# Altium schematic sheet Kajtuś-DSP_power_supply.SchDoc
size A4; DocumentNumber: 9; SheetNumber: 9; SheetTotal: 9
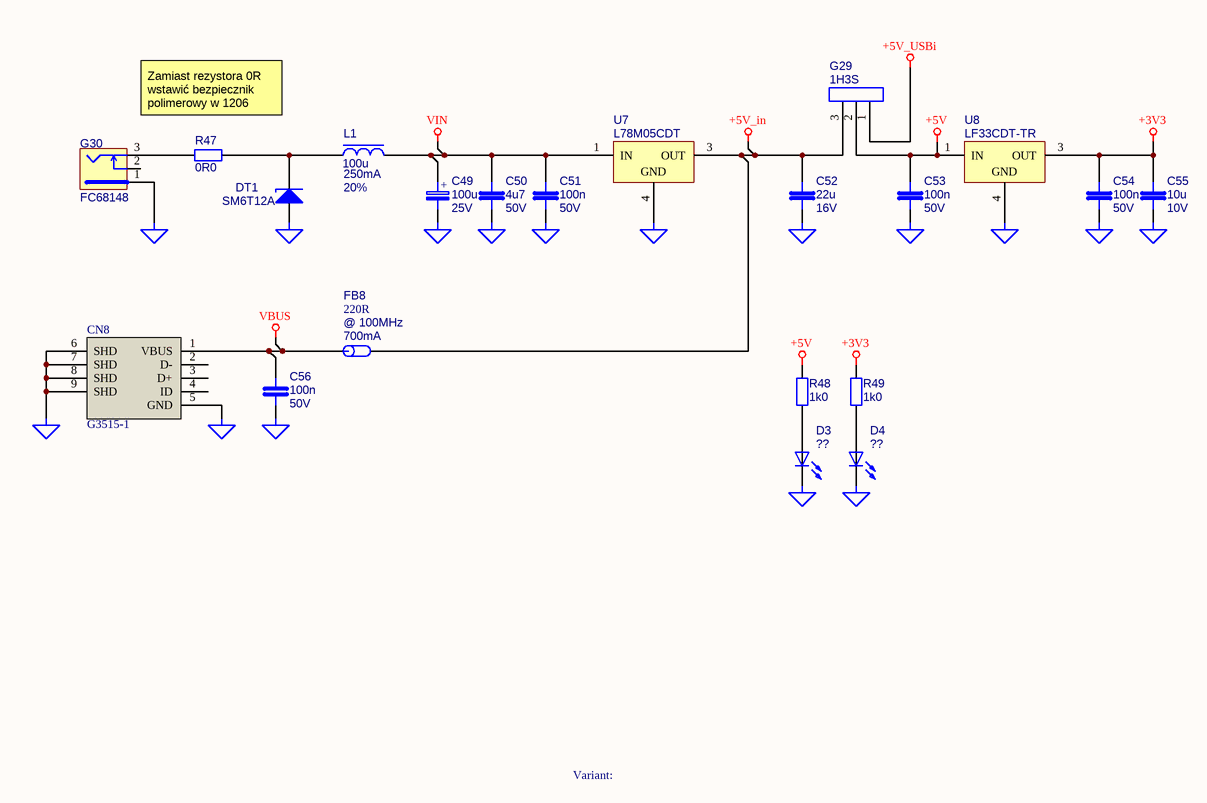
[diagram p0: Kajtuś-DSP_power_supply.SchDoc]

## Parts
C49  100u  Voltage: 25V  [CAPPRD-035-W06-D063-H115]
C50  4u7  Voltage: 50V  [C_1206]
C51  100n  Voltage: 50V  [C_0603]
C52  22u  Voltage: 16V  [C_1206]
C53  100n  Voltage: 50V  [C_0603]
C54  100n  Voltage: 50V  [C_0603]
C55  10u  Voltage: 10V  [C_0805]
C56  100n  Voltage: 50V  [C_0603]
CN8  G3515-1  [CN_USB_mini_B_G3515-1]
D3  ??  [LED_0805_G]
D4  ??  [LED_0805_G]
DT1  SM6T12A  [SMB]
FB8  220R  Frequency: @ 100MHz  Current: 700mA  [FB_0603]
G29  value 1H3S  [1H3S_FHS]  (hidden comment: G_1H3S)
G30  FC68148  [CN_DC_PWR_5.5x2.1_FC68148]
L1  100u  Tolerance: 20%  Current_RMS: 250mA  [Walsin_303015]
R47  value 0R0  [R_1206]  (hidden comment: R_1206_0R0_5%)
R48  value 1k0  [R_0603_MA]  (hidden comment: R_0603_1k0_5%)
R49  value 1k0  [R_0603_MA]  (hidden comment: R_0603_1k0_5%)
U7  L78M05CDT  [TO-252]
U8  LF33CDT-TR  [TO-252_M]

## Nets
+3V3: C54.1 C55.1 R49.1 U8.3(OUT)
+5V: C53.1 G29.2 R48.1 U8.1(IN)
+5V_in: C52.1 FB8.2 G29.3 U7.3(OUT)
+5V_USBi: G29.1
GND: C49.2 C50.2 C51.2 C52.2 C53.2 C54.2 C55.2 C56.2 CN8.5(GND) CN8.6(SHD) CN8.7(SHD) CN8.8(SHD) CN8.9(SHD) D3.2(K) D4.2(K) DT1.2(A) G30.1 U7.4(GND) U8.4(GND)
VBUS: C56.1 CN8.1(VBUS) FB8.1
VIN: C49.1 C50.1 C51.1 L1.2 U7.1(IN)
NetD3_1: D3.1(A) R48.2
NetD4_1: D4.1(A) R49.2
NetDT1_1: DT1.1(C) L1.1 R47.2
NetG30_3: G30.3 R47.1

Not connected (* = marked no-connect by the designer): CN8 2(D-) 3(D+) 4(ID); G30 2

## Notes on the sheet
- Zamiast rezystora 0R wstawić bezpiecznik polimerowy w 1206
- Variant:
- Title
- Size:
- Date:
- A4
- Number:
- Time:
- Revision:
- Sheet
- of
- File:
- (in symbol CE_CAPPRD-035-W06-D063-H115_100u_25V) +

## Library data of the parts
C49 = CE_CAPPRD-035-W06-D063-H115_100u_25V: Aluminum Electrolytic Capacitor, D6.3, H11.5, 100u, 25V, 20%; Parameters: 100u/25V; 20%  6.3x11.5; Tolerance: 20%
C50 = C_1206_4u7_50V_X7R: Ceramic SMD 1206 Capacitor, 4u7, 50V, 10%, X7R; Parametry: 4,7uF, 10%, 50V, X7R; Producent: Hitano; Oznaczenie: 1206 B 475 K 500 N T; Tolerance: 10%; Package: 1206; Dielectric: X7R
C51 C53 C54 = C_0603_100n_50V_X7R: Ceramic SMD 0603 Capacitor, 100n, 50V, X7R; Parametry: 100n; 10%; 50V; X7R; Producent: Hitano; Oznaczenie: 0603 B 104 K 500 N T; Tolerance: 10%; Package: 0603
C52 = C_1206_22u_16V_X5R: Ceramic SMD 1206 Capacitor, 22u, 16V, 10%, X5R; Parametry: 22uF, 20%, 16V, X7R; Producent: Hitano; Oznaczenie: 1206 X 226 M 160 N T; Package: 1206; Tolerance: 10%; Dielectric: X5R
C55 = C_0805_10u_10V_X5R: Ceramic SMD 0805 Capacitor, 10u, 10V, X5R; Parametry: 10u; 10%; 10V; X5R; Producent: Hitano; Oznaczenie: 0805 X 106 K 100 N T; Tolerance: 10%; Package: 0805
C56 = C_0603_100n_50V_X7R: Ceramic SMD 0603 Capacitor, 100n, 50V, X7R; Producent: Hitano; Oznaczenie: 0603 B 104 K 500 N T; Parametry: 100n; 10%; 50V; X7R; Tolerance: 10%; Package: 0603
CN8 = CN_USB_mini-B_G3515-1: Mini USB 1u" S/G W/O Mark S-Type; Producent: Wieson Technologies; Parametry: PIN:5; kątowe, SMD; Oznaczenie: G3515-1; Oznaczenie2: ?; Producent2: ?
D3 D4 = LED_SMD_generic: Dioda LED SMD; Vendor: ??; Part Number: LED_SMD_generic; Manufacturer: ??; Voltage: ??; Current: ??; Manufacturer Part Number: ??; Value: ??
DT1 = DT_SMB_SM6T12A: Dioda Transil, 12V, 600W @ 10/1000us, jednokierunkowa; Manufacturer: Vishay; Voltage: 33V; VBR_min: 11,4V; VBR_max: 12,6V; VC @ 10/1000us: 16,7V; Producent: Vishay; Parametry: 12V, 600W @ 10/1000us, jednokierunkowa; Oznaczenie: SM6T12A; Value: SM6T12A; Supplier 1: TME; Supplier Part Number 1: SM6T12A-E3/52
FB8 = FB_0603_220R_100MHz_700mA: Ferrite Bead; Oznaczenie2: BLM15EG221SN1; Producent2: muRata; Parametry: 220R/100MHz; 700mA; Rdc=0,28; Producent: Erocore; Oznaczenie: CPGF100505T-221Y; Resistance: 0R28; Value: 220R
G29 = G_1H3S: Listwa jednorzędowa, 1x3 piny, raster 2,54mm; Manufacturer: generic; Vendor: TME; Part Number: G_1H3S
G30 = CN_DC_PWR_5.5x2.1_FC68148: DC Power Socket, 5.5mm x 2.1mm, with switch; Vendor: TME; Producent: Cliff; Value: FC68148; Supplier 1: TME; Supplier Part Number 1: FC68148
L1 = L_SMD_303015_WLPN303015M101PB_100u_250mA_20%: Shielded SMD Power Inductors - WLPN303015 Series; Parametry: 100uH, 250mA, 20%; Producent: Walsin; Rdc: 2920m; Current_Sat: 230mA; Vendor: TME; Inductance: 100uH; Oznaczenie: WLPN303015M101PB; Manufacturer: Walsin; Manufacturer Part Number: WLPN303015M101PB; Vendor Part Number: WLPN303015M101PB; Supplier 1: TME; Value: 100u; Supplier Part Number 1: WLPN303015M101PB
R47 = R_1206_0R0_5%: Rezystor SMD; Manufacturer: Royal Ohm; Vendor: TME; Part Number: R_1206_0R0_5%
R48 R49 = R_0603_1k0_5%: Rezystor SMD; Manufacturer: Royal Ohm; Vendor: TME; Tolerance: 5%; Part Number: R_0603_1k0_5%
U7 = L78M05CDT: Positive Voltage Regulator; Published: 24-Aug-2001; LatestRevisionDate: 06-Jun-2005; LatestRevisionNote: PCB pads lengthened.; DatasheetVersion: Apr-1994; PackageVersion: Jun-2004; PackageReference: TO-252; Publisher: Altium Limited; PackageDescription: D-PAK/TO-252-AA; 3 Leads (1 Cropped); Body 10.1 (inc. leads) x 6.6 mm (LxW max); ComponentLink1Description: Manufacturer Link; ComponentLink1URL: http://www.st.com/; ComponentLink2Description: Datasheet; ComponentLink2URL: http://www.st.com/stonline/products/literature/ds/2146/l78m05c.pdf
U8 = LF33CDT-TR: 500mA, Very Low Drop (0.45V) Voltage Regulator, 3.3V, 3-Pin DPAK, Tape and Reel; DatasheetVersion: Nov-2010; PackageVersion: 2011; PackageReference: TO-252; PackageDescription: 3-Pin Transistor Outline Package 2.28 mm Pitch, 9.7 mm Lead Span (DPAK); PartNumber: LF33CDT-TR; ComponentLink1Description: Manufacturer URL; ComponentLink1URL: http://www.st.com; ComponentLink2Description: Datasheet; ComponentLink2URL: http://www.st.com/internet/com/TECHNICAL_RESOURCES/TECHNICAL_LITERATURE/DATASHEET/CD00000546.pdf